# Altium schematic sheet CP2104.SchDoc
size A4
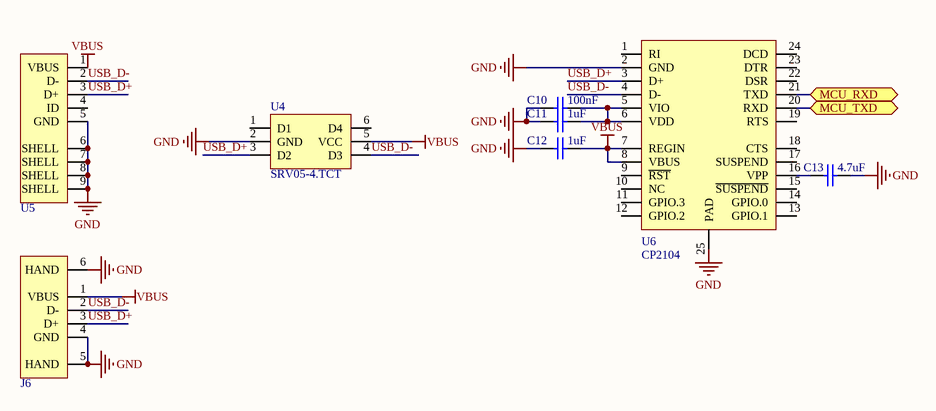
[diagram p0: CP2104.SchDoc]

## Parts
C10  value 100nF  [dq - 0402]  (hidden comment: Cap)
C11  value 1uF  [dq - 0402]  (hidden comment: Cap)
C12  value 1uF  [dq - 0402]  (hidden comment: Cap)
C13  value 4.7uF  [dq - 0603]  (hidden comment: Cap)
J6  USB  [USB-Square-Vertical]  (value not drawn)
U4  SRV05-4.TCT  [LC-SOT-23-6]
U5  Micro-USB-N  [MICRO-USB-F]  (value not drawn)
U6  CP2104  [QFN24 - T]

## Ports
MCU_RXD, MCU_TXD

## Nets
GND: C10.1 C11.1 C12.1 C13.2 J6.4(GND) J6.5(HAND) J6.6(HAND) U4.2(GND) U5.5(GND) U5.6(SHELL) U5.7(SHELL) U5.8(SHELL) U5.9(SHELL) U6.2(GND) U6.25(PAD)
VBUS: C12.2 J6.1(VBUS) U4.5(VCC) U5.1(VBUS) U6.7(REGIN) U6.8(VBUS)
MCU_RXD: U6.21(TXD) ; port MCU_RXD
MCU_TXD: U6.20(RXD) ; port MCU_TXD
USB_D+: J6.3(D+) U4.3(D2) U5.3(D+) U6.3(D+)
USB_D-: J6.2(D-) U4.4(D3) U5.2(D-) U6.4(D-)
NetC10_2: C10.2 C11.2 U6.5(VIO) U6.6(VDD)
NetC13_1: C13.1 U6.16(VPP)

Not connected (* = marked no-connect by the designer): U4 1(D1) 6(D4); U5 4(ID); U6 1(RI) 9(~{RST}) 10(NC) 11(GPIO.3) 12(GPIO.2) 13(GPIO.1) 14(GPIO.0) 15(~{SUSPEND}) 17(SUSPEND) 18(CTS) 19(RTS) 22(DSR) 23(DTR) 24(DCD)

## Library data of the parts
C10-C13 = DQ_Cap: Capacitor; Published: 8-Jun-2000; LatestRevisionDate: 17-Jul-2002; LatestRevisionNote: Re-released for DXP Platform.; PackageReference: RAD-0.3; Publisher: Altium Limited